# Altium project Ligth.PrjPCB
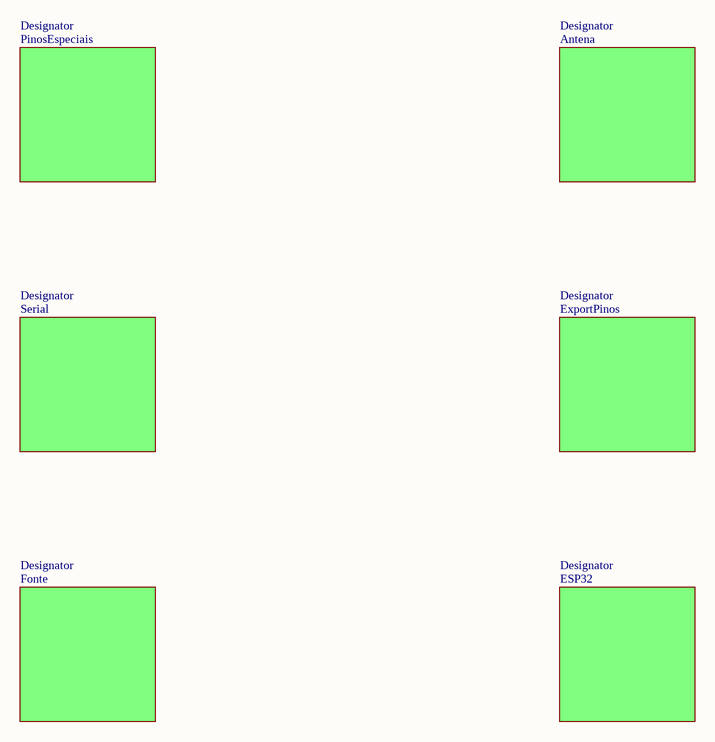
[diagram p0: Main.SchDoc]
7 sheets, 35 parts. Net scope: global (net labels, ports and power ports of the same name join across sheets).
Board file: Ligth.PcbDoc
Sheets:
  Main.SchDoc
    Designator = Serial.SchDoc
    Designator = Fonte.SchDoc
    Designator = PinosEspeciais.SchDoc
    Designator = ESP32.SchDoc
    Designator = ExportPinos.SchDoc
    Designator = Antena.SchDoc

## Sheet Main.SchDoc
size A4

### Sub-sheets
Designator = Serial: no entries
Designator = Fonte: no entries
Designator = PinosEspeciais: no entries
Designator = ESP32: no entries
Designator = ExportPinos: no entries
Designator = Antena: no entries

## Sheet Serial.SchDoc
size A4
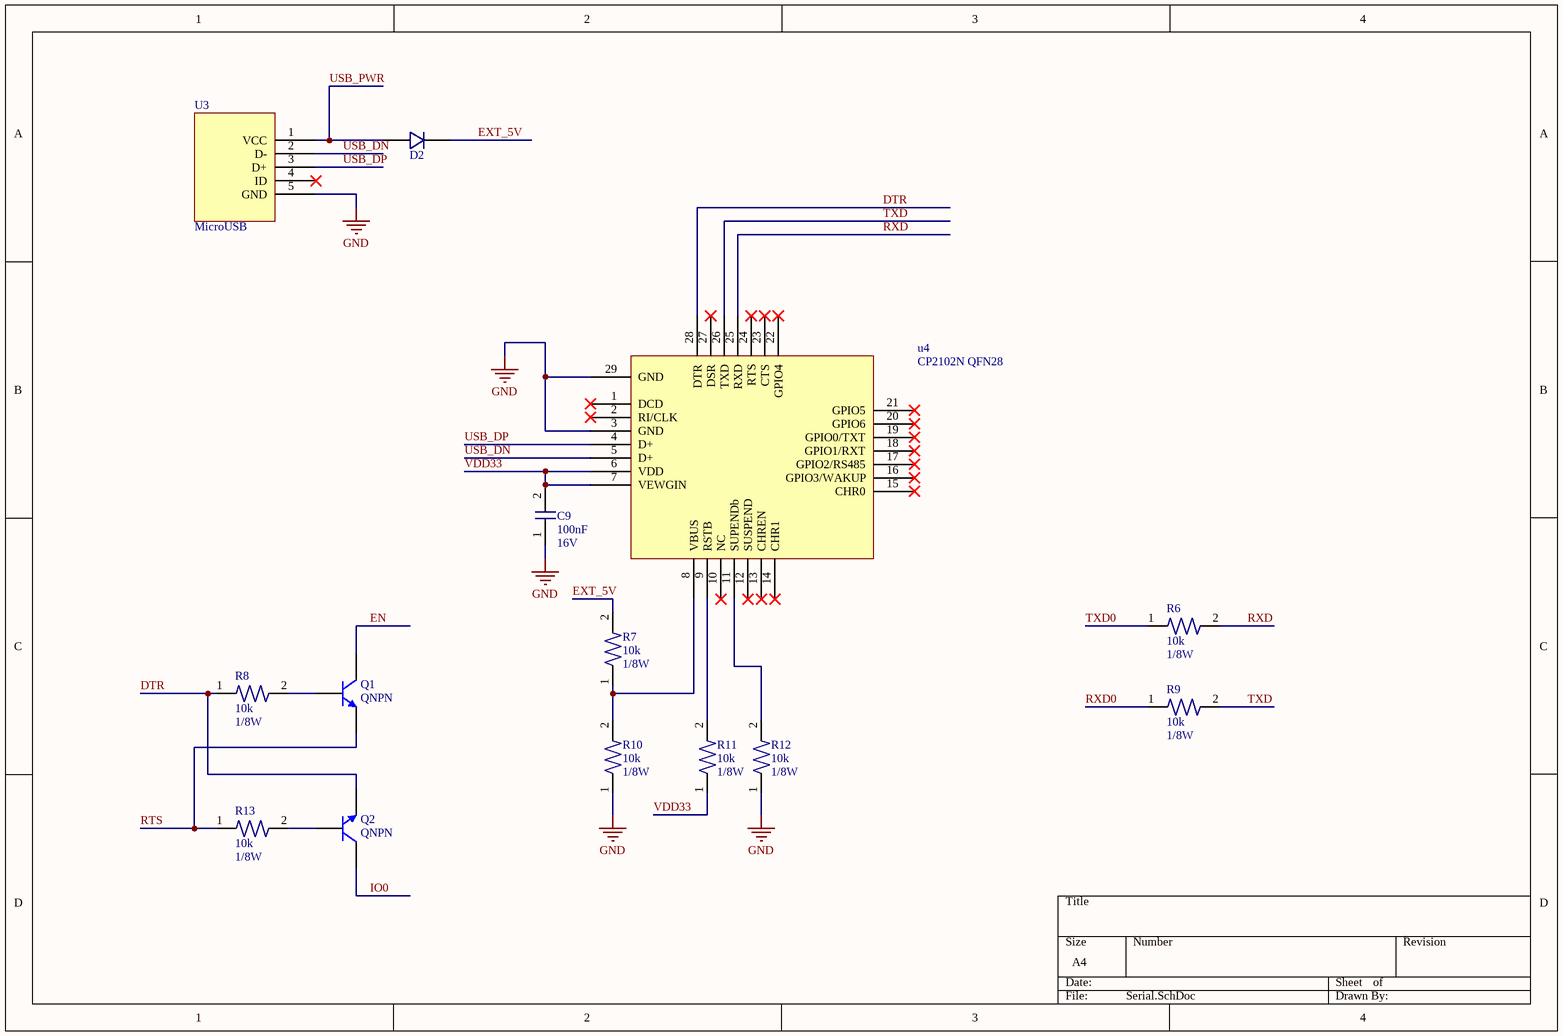
[diagram p1: Serial.SchDoc]

### Parts
C9  Capacitance: 100nF  Voltage: 16V  [CAP 100nF/16V]  (hidden comment: CAP 100nF/16V)
D2  ES1F  [ES1F SMA Package]  (value not drawn)
Q1  QNPN  [SOT-23B_N]
Q2  QNPN  [SOT-23B_N]
R6  Resistence: 10k  Power: 1/8W  [RES 10k 1% 1/8W]  (hidden comment: RES 0603)
R7  Resistence: 10k  Power: 1/8W  [RES 10k 1% 1/8W]  (hidden comment: RES 0603)
R8  Resistence: 10k  Power: 1/8W  [RES 10k 1% 1/8W]  (hidden comment: RES 0603)
R9  Resistence: 10k  Power: 1/8W  [RES 10k 1% 1/8W]  (hidden comment: RES 0603)
R10  Resistence: 10k  Power: 1/8W  [RES 10k 1% 1/8W]  (hidden comment: RES 0603)
R11  Resistence: 10k  Power: 1/8W  [RES 10k 1% 1/8W]  (hidden comment: RES 0603)
R12  Resistence: 10k  Power: 1/8W  [RES 10k 1% 1/8W]  (hidden comment: RES 0603)
R13  Resistence: 10k  Power: 1/8W  [RES 10k 1% 1/8W]  (hidden comment: RES 0603)
U3  MicroUSB  [MicroUSB]
u4  CP2102N QFN28  [CP2102N QFN28]

### Nets
GND: C9.1 R10.1 R12.1 U3.5(GND) u4.3(GND) u4.29(GND)
DTR: Q2.3(E) R8.1 u4.28(DTR)
EN: Q1.1(C)
EXT_5V: C9.2 D2.K R7.2 R11.1 u4.6(VDD) u4.7(VEWGIN)  [also labelled VDD33]
IO0: Q2.1(C)
RTS: Q1.3(E) R13.1
RXD: R6.2 u4.25(RXD)
RXD0: R9.1
TXD: R9.2 u4.26(TXD)
TXD0: R6.1
USB_DN: U3.2(D-) u4.5(D+)
USB_DP: U3.3(D+) u4.4(D+)
USB_PWR: D2.A U3.1(VCC)
NetQ1_2: Q1.2(B) R8.2
NetQ2_2: Q2.2(B) R13.2
NetR7_1: R7.1 R10.2 u4.8(VBUS)
NetR11_2: R11.2 u4.9(RSTB)
NetR12_2: R12.2 u4.11(SUPENDb)

Not connected (* = marked no-connect by the designer): U3 4(ID)*; u4 1(DCD)* 2(RI/CLK)* 10(NC)* 12(SUSPEND)* 13(CHREN)* 14(CHR1)* 15(CHR0)* 16(GPIO3/WAKUP)* 17(GPIO2/RS485)* 18(GPIO1/RXT)* 19(GPIO0/TXT)* 20(GPIO6)* 21(GPIO5)* 22(GPIO4)* 23(CTS)* 24(RTS)* 27(DSR)*

### Library data of the parts
C9 = CAP 100nF/16V: 0.1µF ±20% 16V Ceramic Capacitor Y5V (F) 0805 (2012 Metric); Manufacturer 1: Samsung Electro-Mechanics; Manufacturer 1 PN: CL21A106KOQNNWE; Mouser PN: 581-08055C104K4Z4A; Digikey PN: 1276-2894-1-ND; ComponentLink1Description: Specifications; ComponentLink1URL: http://www.samsungsem.com/kr/support/product-search/mlcc/__icsFiles/afieldfile/2018/07/27/CL21A106KOQNNWE.pdf
D2 = ES1F SMA: Diode Standard 300V 1A Surface Mount SMA (DO-214AC); Manufacturer 1: ON Semiconductor; Manufacturer 1 PN: ES1F; ComponentLink1Description: Datasheet; ComponentLink1URL: https://www.fairchildsemi.com/datasheets/ES/ES1F.pdf; Voltage: 300V; Current: 1A
Q1 Q2 = QNPN: NPN Bipolar Transistor; Published: 8-Jun-2000; LatestRevisionDate: 29-May-2009; LatestRevisionNote: IPC-7351 Footprint Added.; PackageVersion: Aug-1999; PackageReference: SOT-23B; Publisher: Altium Limited; PackageDescription: 3-Pin SOT-23 Package 0.95 mm Pitch, 2.4 mm Lead Span
R6-R13 = RES 10k 1% 1/8W: 10 kOhms ±1% 0.125W, 1/8W Chip Resistor 0603 (1608 Metric) Anti-Sulfur, Moisture Resistant Thin Film; Manufacturer 1: Stackpole Electronics Inc.; Manufacturer 1 PN: RNCP0603FTD10K0; Digikey PN: RNCP0603FTD10K0CT-ND; ComponentLink1Description: Datasheet; ComponentLink1URL: http://www.yageo.com/documents/recent/PYu-RC_Group_51_RoHS_L_9.pdf; Mouser PN: 755-ESR03EZPF1002
U3 = MicroUSB: ComponentLink1Description: LCSC; ComponentLink1URL: https://lcsc.com/product-detail/Micro-USB-Connectors_MICRO-5PFemaleBtype-High-temperature_C46390.html?currency=EUR; ComponentLink2Description: Datasheet; ComponentLink2URL: https://datasheet.lcsc.com/szlcsc/1912111436_LCSC-C46390_C46390.pdf

## Sheet Fonte.SchDoc
size A4
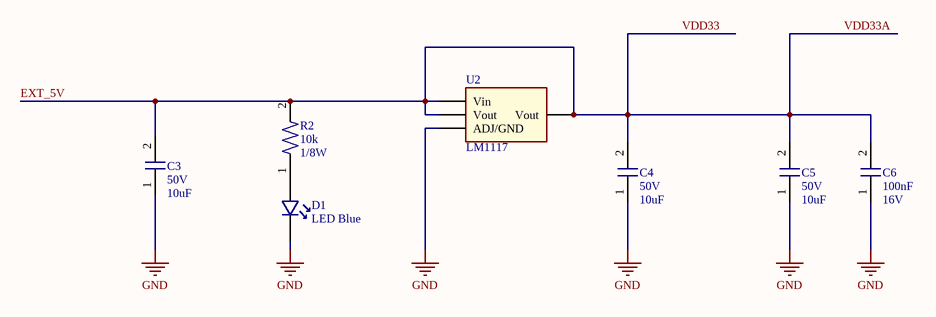
[diagram p2: Fonte.SchDoc]

### Parts
C3  Voltage: 50V  Capacitance: 10uF  [CAP 10uF/50V]  (hidden comment: CAP 10uF/50V)
C4  Voltage: 50V  Capacitance: 10uF  [CAP 10uF/50V]  (hidden comment: CAP 10uF/50V)
C5  Voltage: 50V  Capacitance: 10uF  [CAP 10uF/50V]  (hidden comment: CAP 10uF/50V)
C6  Capacitance: 100nF  Voltage: 16V  [CAP 100nF/16V]  (hidden comment: CAP 100nF/16V)
D1  LED Blue  [LED Blue]
R2  Resistence: 10k  Power: 1/8W  [RES 10k 1% 1/8W]  (hidden comment: RES 0603)
U2  LM1117  [LM1117]

### Nets
GND: C3.1 C4.1 C5.1 C6.1 D1.K U2.1(ADJ/GND)
EXT_5V: C3.2 C4.2 C5.2 C6.2 R2.2 U2.2(Vout) U2.3(Vin) U2.4(Vout)  [also labelled VDD33, VDD33A]
NetD1_A: D1.A R2.1

### Library data of the parts
C3-C5 = CAP  10uF/50V: 10uF ±1% 50V Ceramic Capacitor C0G, NP0 0805 (2012 Metric); Manufacturer 1: Murata Electronics North America; Manufacturer 1 PN: GRM2165C1H102FA01D; Digikey PN: 490-6441-1-ND; Mouser PN: 81-GRM2165C1H102FA01; ComponentLink1Description: Datasheet; ComponentLink1URL: https://www.murata.com/~/media/webrenewal/support/library/catalog/products/capacitor/mlcc/c02e.ashx?la=en-us
C6 = CAP 100nF/16V: as C9 on sheet Serial; Mouser PN: 581-08055C104K4Z4A; Digikey PN: 1276-2894-1-ND; ComponentLink1Description: Specifications; ComponentLink1URL: http://www.samsungsem.com/kr/support/product-search/mlcc/__icsFiles/afieldfile/2018/07/27/CL21A106KOQNNWE.pdf
D1 = LED Blue: Blue 470nm LED Indication - Discrete 3.3V 0805 (2012 Metric); Manufacturer 1: Lite-On Inc.; Manufacturer 1 PN: LTST-C171TBKT
R2 = RES 10k 1% 1/8W: as R6 on sheet Serial; Digikey PN: RNCP0603FTD10K0CT-ND; ComponentLink1Description: Datasheet; ComponentLink1URL: http://www.yageo.com/documents/recent/PYu-RC_Group_51_RoHS_L_9.pdf; Mouser PN: 755-ESR03EZPF1002
U2 = LM1117: Linear Voltage Regulator IC Positive Fixed 1 Output 3.3V 1A SOT-223; Manufacturer 1: Diodes Incorporated; Manufacturer 1 PN: AZ1117EH-3.3TRG1; Manufacturer 2 PN: LD1117S33TR; Notes: Every PMIC named 1117 is the same; Manufacturer 2: STMicroelectronics; Digikey PN: AZ1117EH-3.3TRG1DICT-ND; Mouser PN: 621-AZ1117EH-3.3TRG1; ComponentLink1Description: Datasheet; ComponentLink1URL: https://www.diodes.com/assets/Datasheets/AZ1117E.pdf

## Sheet PinosEspeciais.SchDoc
size A4
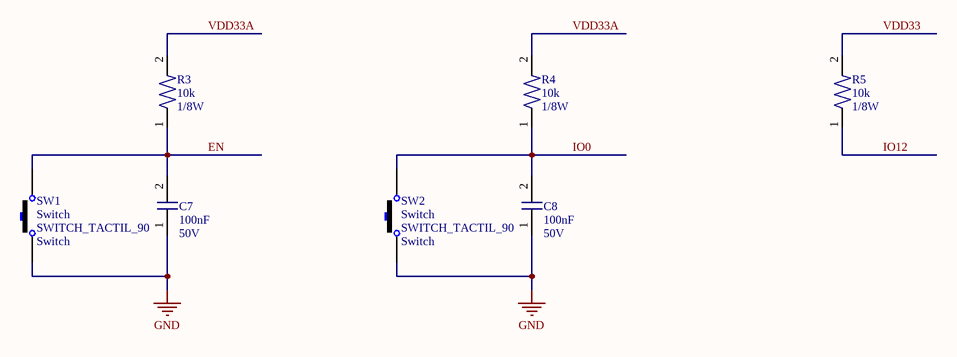
[diagram p3: PinosEspeciais.SchDoc]

### Parts
C7  Capacitance: 100nF  Voltage: 50V  [CAPC1005X05N]  (hidden comment: CAP 100nF/50V)
C8  Capacitance: 100nF  Voltage: 50V  [CAPC1005X05N]  (hidden comment: CAP 100nF/50V)
R3  Resistence: 10k  Power: 1/8W  [RES 10k 1% 1/8W]  (hidden comment: RES 0603)
R4  Resistence: 10k  Power: 1/8W  [RES 10k 1% 1/8W]  (hidden comment: RES 0603)
R5  Resistence: 10k  Power: 1/8W  [RES 10k 1% 1/8W]  (hidden comment: RES 0603)
SW1  Switch  [SWITCH_TACTIL_90]
SW2  Switch  [SWITCH_TACTIL_90]

### Nets
GND: C7.1 C8.1 SW1.1 SW2.1
EN: C7.2 R3.1 SW1.2
IO0: C8.2 R4.1 SW2.2
IO12: R5.1
VDD33: R3.2 R4.2 R5.2  [also labelled VDD33A]  [project net EXT_5V]

### Library data of the parts
C7 C8 = CAP 100nF/50V: 0.1µF ±10% 50V Ceramic Capacitor X5R 0402 (1005 Metric); Manufacturer 1: Yageo; Manufacturer 1 PN: CC0402KRX5R9BB104; Digikey PN: 311-3342-1-ND; ComponentLink1Description: Datasheet; ComponentLink1URL: https://search.murata.co.jp/Ceramy/image/img/A01X/G101/ENG/GRM022R60J103KE19-01.pdf
R3-R5 = RES 10k 1% 1/8W: as R6 on sheet Serial; Digikey PN: RNCP0603FTD10K0CT-ND; ComponentLink1Description: Datasheet; ComponentLink1URL: http://www.yageo.com/documents/recent/PYu-RC_Group_51_RoHS_L_9.pdf; Mouser PN: 755-ESR03EZPF1002
SW1 SW2 = SWITCH_TACTIL_90: Value: Switch

## Sheet ESP32.SchDoc
size A4
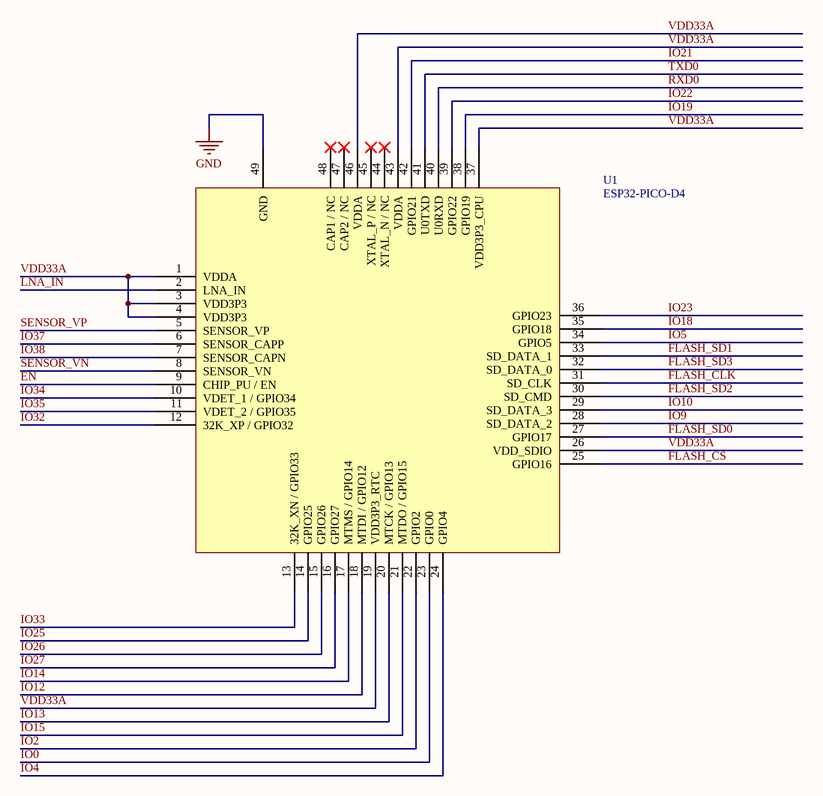
[diagram p4: ESP32.SchDoc]

### Parts
U1  ESP32-PICO-D4  [ESP32-PICO-D4]

### Nets
GND: U1.49(GND)
EN: U1.9(CHIP_PU_/_EN)
FLASH_CLK: U1.31(SD_CLK)
FLASH_CS: U1.25(GPIO16)
FLASH_SD0: U1.27(GPIO17)
FLASH_SD1: U1.33(SD_DATA_1)
FLASH_SD2: U1.30(SD_CMD)
FLASH_SD3: U1.32(SD_DATA_0)
IO0: U1.23(GPIO0)
IO2: U1.22(GPIO2)
IO4: U1.24(GPIO4)
IO5: U1.34(GPIO5)
IO9: U1.28(SD_DATA_2)
IO10: U1.29(SD_DATA_3)
IO12: U1.18(MTDI_/_GPIO12)
IO13: U1.20(MTCK_/_GPIO13)
IO14: U1.17(MTMS_/_GPIO14)
IO15: U1.21(MTDO_/_GPIO15)
IO18: U1.35(GPIO18)
IO19: U1.38(GPIO19)
IO21: U1.42(GPIO21)
IO22: U1.39(GPIO22)
IO23: U1.36(GPIO23)
IO25: U1.14(GPIO25)
IO26: U1.15(GPIO26)
IO27: U1.16(GPIO27)
IO32: U1.12(32K_XP_/_GPIO32)
IO33: U1.13(32K_XN_/_GPIO33)
IO34: U1.10(VDET_1_/_GPIO34)
IO35: U1.11(VDET_2_/_GPIO35)
IO37: U1.6(SENSOR_CAPP)
IO38: U1.7(SENSOR_CAPN)
LNA_IN: U1.2(LNA_IN)
RXD0: U1.40(U0RXD)
SENSOR_VN: U1.8(SENSOR_VN)
SENSOR_VP: U1.5(SENSOR_VP)
TXD0: U1.41(U0TXD)
VDD33A: U1.1(VDDA) U1.3(VDD3P3) U1.4(VDD3P3) U1.19(VDD3P3_RTC) U1.26(VDD_SDIO) U1.37(VDD3P3_CPU) U1.43(VDDA) U1.46(VDDA)  [project net EXT_5V]

Not connected (* = marked no-connect by the designer): U1 44(XTAL_N_/_NC)* 45(XTAL_P_/_NC)* 47(CAP2_/_NC)* 48(CAP1_/_NC)*

### Library data of the parts
U1 = ESP32-PICO-D4: RF TRANSCEIVER ICS QFN-48_7X7X05P ROHS; Manufacturer: Espressif Systems; ComponentLink1Description: Datasheet; ComponentLink1URL: https://datasheet.lcsc.com/szlcsc/Espressif-Systems-ESP32-PICO-D4_C193707.pdf; ComponentLink2Description: Datasheet_EN; ComponentLink2URL: https://www.espressif.com/sites/default/files/documentation/esp32-pico-d4_datasheet_en.pdf; MFR.Part #: ESP32-PICO-D4; LCSC Part #: C193707; Package: QFN-48_EP_7.0x7.0x0.5P

## Sheet ExportPinos.SchDoc
size A4
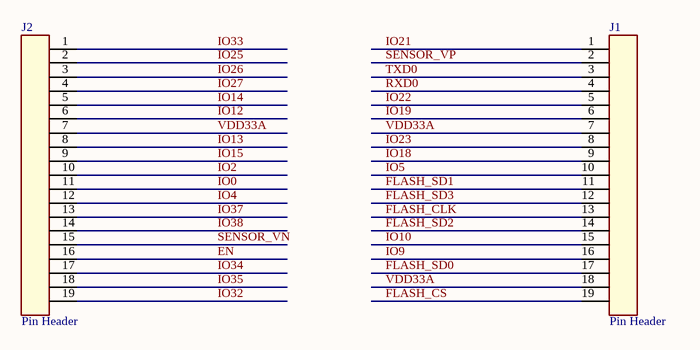
[diagram p5: ExportPinos.SchDoc]

### Parts
J1  Pin Header  [Pin Header 19 Ways]
J2  Pin Header  [Pin Header 19 Ways]

### Nets
EN: J2.16
FLASH_CLK: J1.13
FLASH_CS: J1.19
FLASH_SD0: J1.17
FLASH_SD1: J1.11
FLASH_SD2: J1.14
FLASH_SD3: J1.12
IO0: J2.11
IO2: J2.10
IO4: J2.12
IO5: J1.10
IO9: J1.16
IO10: J1.15
IO12: J2.6
IO13: J2.8
IO14: J2.5
IO15: J2.9
IO18: J1.9
IO19: J1.6
IO21: J1.1
IO22: J1.5
IO23: J1.8
IO25: J2.2
IO26: J2.3
IO27: J2.4
IO32: J2.19
IO33: J2.1
IO34: J2.17
IO35: J2.18
IO37: J2.13
IO38: J2.14
RXD0: J1.4
SENSOR_VN: J2.15
SENSOR_VP: J1.2
TXD0: J1.3
VDD33A: J1.7 J1.18 J2.7  [project net EXT_5V]

### Library data of the parts
J1 J2 = Pin Header 19 ways: Connector Header PTH 0.100" (2.54mm); Manufacturer 1: Irwin Inc.; Manufacturer 1 PN: M20-9992046

## Sheet Antena.SchDoc
size A4
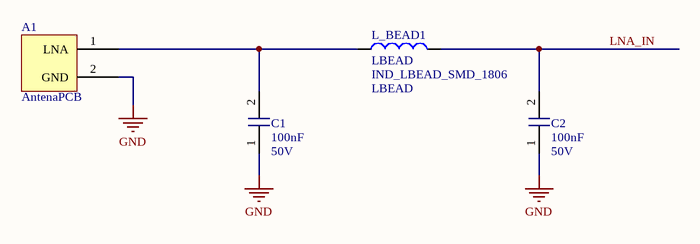
[diagram p6: Antena.SchDoc]

### Parts
A1  AntenaPCB  [PCBComponent_1]
C1  Capacitance: 100nF  Voltage: 50V  [CAP 100nF/50V]  (hidden comment: CAP 100nF/50V)
C2  Capacitance: 100nF  Voltage: 50V  [CAP 100nF/50V]  (hidden comment: CAP 100nF/50V)
L_BEAD1  LBEAD  [IND_LBEAD_SMD_1806]

### Nets
GND: A1.2(GND) C1.1 C2.1
LNA_IN: C2.2 L_BEAD1.2
NetA1_1: A1.1(LNA) C1.2 L_BEAD1.1

### Library data of the parts
C1 C2 = CAP 100nF/50V: as C7 on sheet PinosEspeciais; Digikey PN: 311-3342-1-ND; ComponentLink1Description: Datasheet; ComponentLink1URL: https://search.murata.co.jp/Ceramy/image/img/A01X/G101/ENG/GRM022R60J103KE19-01.pdf
L_BEAD1 = IND_LBEAD_SMD_1806: Inductor LBEAD; Value: LBEAD

## Nets that join several sheets
GND: Serial (6 pins), Fonte (6 pins), PinosEspeciais (C7.1 C8.1 SW1.1 SW2.1), ESP32 (U1.49), Antena (A1.2 C1.1 C2.1)
EN: Serial (Q1.1), PinosEspeciais (C7.2 R3.1 SW1.2), ESP32 (U1.9), ExportPinos (J2.16)
EXT_5V: Serial (6 pins), Fonte (8 pins), PinosEspeciais (R3.2 R4.2 R5.2), ESP32 (8 pins), ExportPinos (J1.7 J1.18 J2.7)
FLASH_CLK: ESP32 (U1.31), ExportPinos (J1.13)
FLASH_CS: ESP32 (U1.25), ExportPinos (J1.19)
FLASH_SD0: ESP32 (U1.27), ExportPinos (J1.17)
FLASH_SD1: ESP32 (U1.33), ExportPinos (J1.11)
FLASH_SD2: ESP32 (U1.30), ExportPinos (J1.14)
FLASH_SD3: ESP32 (U1.32), ExportPinos (J1.12)
IO0: Serial (Q2.1), PinosEspeciais (C8.2 R4.1 SW2.2), ESP32 (U1.23), ExportPinos (J2.11)
IO2: ESP32 (U1.22), ExportPinos (J2.10)
IO4: ESP32 (U1.24), ExportPinos (J2.12)
IO5: ESP32 (U1.34), ExportPinos (J1.10)
IO9: ESP32 (U1.28), ExportPinos (J1.16)
IO10: ESP32 (U1.29), ExportPinos (J1.15)
IO12: PinosEspeciais (R5.1), ESP32 (U1.18), ExportPinos (J2.6)
IO13: ESP32 (U1.20), ExportPinos (J2.8)
IO14: ESP32 (U1.17), ExportPinos (J2.5)
IO15: ESP32 (U1.21), ExportPinos (J2.9)
IO18: ESP32 (U1.35), ExportPinos (J1.9)
IO19: ESP32 (U1.38), ExportPinos (J1.6)
IO21: ESP32 (U1.42), ExportPinos (J1.1)
IO22: ESP32 (U1.39), ExportPinos (J1.5)
IO23: ESP32 (U1.36), ExportPinos (J1.8)
IO25: ESP32 (U1.14), ExportPinos (J2.2)
IO26: ESP32 (U1.15), ExportPinos (J2.3)
IO27: ESP32 (U1.16), ExportPinos (J2.4)
IO32: ESP32 (U1.12), ExportPinos (J2.19)
IO33: ESP32 (U1.13), ExportPinos (J2.1)
IO34: ESP32 (U1.10), ExportPinos (J2.17)
IO35: ESP32 (U1.11), ExportPinos (J2.18)
IO37: ESP32 (U1.6), ExportPinos (J2.13)
IO38: ESP32 (U1.7), ExportPinos (J2.14)
LNA_IN: ESP32 (U1.2), Antena (C2.2 L_BEAD1.2)
RXD0: Serial (R9.1), ESP32 (U1.40), ExportPinos (J1.4)
SENSOR_VN: ESP32 (U1.8), ExportPinos (J2.15)
SENSOR_VP: ESP32 (U1.5), ExportPinos (J1.2)
TXD0: Serial (R6.1), ESP32 (U1.41), ExportPinos (J1.3)